# EAGLE schematic main (EAGLE 7.7.0)
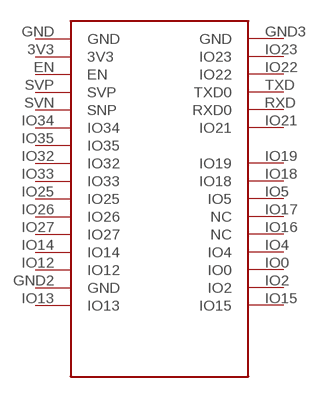
[diagram p0: schematic, sheet 1]

## Parts
ESP-32S-ADAPTER-PCB1  ESP-32S-ADAPTER-BREAKOUT  [ESP-32S-ADAPTER-PCB]
Unconnected: ESP-32S-ADAPTER-PCB1.3V3 ESP-32S-ADAPTER-PCB1.EN ESP-32S-ADAPTER-PCB1.GND ESP-32S-ADAPTER-PCB1.GND2(GND) ESP-32S-ADAPTER-PCB1.GND3(GND) ESP-32S-ADAPTER-PCB1.IO0 ESP-32S-ADAPTER-PCB1.IO2 ESP-32S-ADAPTER-PCB1.IO4 ESP-32S-ADAPTER-PCB1.IO5 ESP-32S-ADAPTER-PCB1.IO12 ESP-32S-ADAPTER-PCB1.IO13 ESP-32S-ADAPTER-PCB1.IO14 ESP-32S-ADAPTER-PCB1.IO15 ESP-32S-ADAPTER-PCB1.IO16(NC) ESP-32S-ADAPTER-PCB1.IO17(NC) ESP-32S-ADAPTER-PCB1.IO18 ESP-32S-ADAPTER-PCB1.IO19 ESP-32S-ADAPTER-PCB1.IO21 ESP-32S-ADAPTER-PCB1.IO22 ESP-32S-ADAPTER-PCB1.IO23 ESP-32S-ADAPTER-PCB1.IO25 ESP-32S-ADAPTER-PCB1.IO26 ESP-32S-ADAPTER-PCB1.IO27 ESP-32S-ADAPTER-PCB1.IO32 ESP-32S-ADAPTER-PCB1.IO33 ESP-32S-ADAPTER-PCB1.IO34 ESP-32S-ADAPTER-PCB1.IO35 ESP-32S-ADAPTER-PCB1.RXD(RXD0) ESP-32S-ADAPTER-PCB1.SVN(SNP) ESP-32S-ADAPTER-PCB1.SVP ESP-32S-ADAPTER-PCB1.TXD(TXD0)

## Library data of the parts
ESP-32S-ADAPTER-PCB1 = ESP-32s-adapter-breakout:ESP-32S-ADAPTER-BREAKOUT